# Altium project Bicikli.PrjPcb
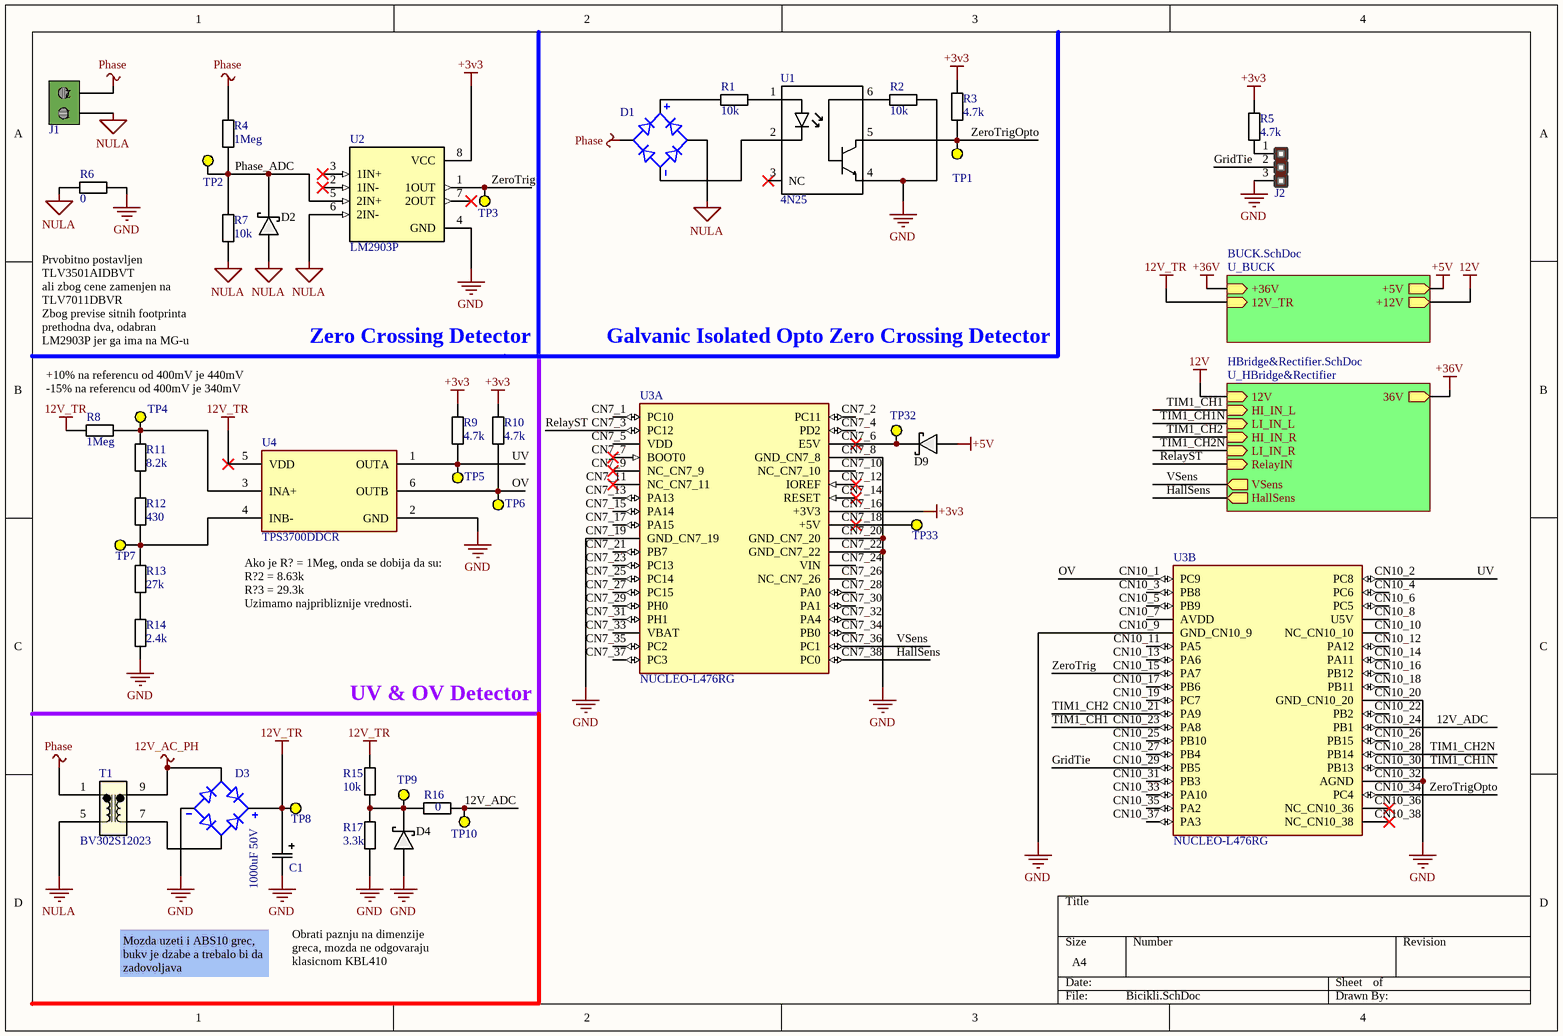
[diagram p0: Bicikli.SchDoc]
3 sheets, 165 parts. Net scope: hierarchical (ports join the sheet entries above them; power ports are global).
Board file: Bicikli_V1.PcbDoc
Sheets:
  Bicikli.SchDoc
    U_HBridge&Rectifier = HBridge&Rectifier.SchDoc
    U_BUCK = BUCK.SchDoc

## Sheet Bicikli.SchDoc
size A4; SheetNumber: 1; SheetTotal: 3

### Parts
C1  1000uF 50V  [CAP_12.5 X 25_NCH]
D1  KBP208G  [SIP350W80P400L1450H1280Q4]  (value not drawn)
D2  SCH_DIODE  [SMA]  (value not drawn)
D3  KBP208G  [SIP350W80P400L1450H1280Q4]  (value not drawn)
D4  SCH_DIODE  [SMA]  (value not drawn)
D9  SCH_DIODE  [SMA]  (value not drawn)
J1  Wire Terminal Block 2 pin 5mm  [WireTerminalPCB5mm2PIN]  (value not drawn)
J2  3Pin  [HEADER3PIN]  (value not drawn)
R1  10k  [RESISTOR_THRUHOLE_1/4W]
R2  10k  [RESISTOR_0805]
R3  4.7k  [RESISTOR_0805]
R4  1Meg  [RESISTOR_THRUHOLE_1/4W]
R5  4.7k  [RESISTOR_0805]
R6  0  [RESISTOR_1206]
R7  10k  [RESISTOR_THRUHOLE_1/4W]
R8  1Meg  [RESISTOR_0805]
R9  4.7k  [RESISTOR_0805]
R10  4.7k  [RESISTOR_0805]
R11  8.2k  [RESISTOR_0805]
R12  430  [RESISTOR_0805]
R13  27k  [RESISTOR_0805]
R14  2.4k  [RESISTOR_0805]
R15  10k  [RESISTOR_0805]
R16  0  [RESISTOR_0805]
R17  3.3k  [RESISTOR_0805]
T1  BV302S12023  [BV302S12023_ZLM]
TP1  TP  [TP]  (value not drawn)
TP2  TP  [TP]  (value not drawn)
TP3  TP  [TP]  (value not drawn)
TP4  TP  [TP]  (value not drawn)
TP5  TP  [TP]  (value not drawn)
TP6  TP  [TP]  (value not drawn)
TP7  TP  [TP]  (value not drawn)
TP8  TP  [TP]  (value not drawn)
TP9  TP  [TP]  (value not drawn)
TP10  TP  [TP]  (value not drawn)
TP32  TP  [TP]  (value not drawn)
TP33  TP  [TP]  (value not drawn)
U1  4N25  [DIP762W50P254L712H400Q6N]
U2  LM2903P  [DIP794W45P254L959H508Q8]
U3  NUCLEO-L476RG  [MODULE_NUCLEO-L476RG]  (parts A,B of 2)
U4  TPS3700DDCR  [FP-DDC0006A-IPC_A]

### Sub-sheets
U_BUCK = BUCK.SchDoc: +5V (out), +36V (in), +12V (out), 12V_TR (in)
U_HBridge&Rectifier = HBridge&Rectifier.SchDoc: HallSens (out), VSens (out), RelayIN (in), HI_IN_L (in), LI_IN_L (in), HI_IN_R (in), LI_IN_R (in), 12V (in), 36V (out)

### Nets
12V: sheet U_HBridge&Rectifier/12V, sheet U_BUCK/+12V
12V_AC_PH: D3.3(AC2) T1.9
12V_TR: C1.1 D3.1(POS) R8.2 R15.2 TP8.1 U4.5(VDD) ; sheet U_BUCK/12V_TR
+3v3: R3.2 R5.2 R9.2 R10.2 U2.8(VCC) U3.CN7_16(+3V3)
+5V: D9.1 ; sheet U_BUCK/+5V
+36V: sheet U_HBridge&Rectifier/36V, sheet U_BUCK/+36V
GND: C1.2 D3.4(NEG) D4.1 J2.3 R2.1 R6.1 R14.1 R17.1 U1.4(E) U2.4(GND) U3.CN7_8(GND_CN7_8) U3.CN7_19(GND_CN7_19) U3.CN7_20(GND_CN7_20) U3.CN7_22(GND_CN7_22) U3.CN10_9(GND_CN10_9) U3.CN10_20(GND_CN10_20) U3.CN10_32(AGND) U4.2(GND)
NULA: D1.2(AC1) D2.1 J1.1 R6.2 R7.1 T1.5 U2.6(2IN-)
Phase: D1.3(AC2) J1.2 R4.2 T1.1
12V_ADC: R16.2 TP10.1 U3.CN10_24(PB1)
GridTie: J2.2 U3.CN10_29(PB5)
HallSens: U3.CN7_38(PC0) ; sheet U_HBridge&Rectifier/HallSens
OV: R10.1 TP6.1 U3.CN10_1(PC9) U4.6(OUTB)
Phase_ADC: D2.2 R4.1 R7.2 TP2.1 U2.5(2IN+)
RelayST: U3.CN7_3(PC12) ; sheet U_HBridge&Rectifier/RelayIN
TIM1_CH1: U3.CN10_23(PA8) ; sheet U_HBridge&Rectifier/HI_IN_L
TIM1_CH1N: U3.CN10_30(PB13) ; sheet U_HBridge&Rectifier/LI_IN_L
TIM1_CH2: U3.CN10_21(PA9) ; sheet U_HBridge&Rectifier/HI_IN_R
TIM1_CH2N: U3.CN10_28(PB14) ; sheet U_HBridge&Rectifier/LI_IN_R
UV: R9.1 TP5.1 U3.CN10_2(PC8) U4.1(OUTA)
VSens: U3.CN7_36(PC1) ; sheet U_HBridge&Rectifier/VSens
ZeroTrig: TP3.1 U2.1(1OUT) U3.CN10_15(PA7)
ZeroTrigOpto: R3.1 TP1.1 U1.5(C) U3.CN10_34(PC4)
NetD1_1: D1.1(POS) R1.2
NetD1_4: D1.4(NEG) U1.2(K)
NetD3_2: D3.2(AC1) T1.7
NetD4_2: D4.2 R15.1 R16.1 R17.2 TP9.1
NetD9_2: D9.2 TP32.1 U3.CN7_6(E5V)
NetJ2_1: J2.1 R5.1
NetR1_1: R1.1 U1.1(A)
NetR2_2: R2.2 U1.6(B)
NetR8_1: R8.1 R11.2 TP4.1 U4.3(INA+)
NetR11_1: R11.1 R12.2
NetR12_1: R12.1 R13.2 TP7.1 U4.4(INB-)
NetR13_1: R13.1 R14.2
NetTP33_1: TP33.1 U3.CN7_18(+5V)

Not connected (* = marked no-connect by the designer): U1 3(NC)*; U2 2(1IN-)* 3(1IN+)* 7(2OUT)*; U3 CN7_1(PC10) CN7_2(PC11) CN7_4(PD2) CN7_5(VDD) CN7_7(BOOT0)* CN7_9(NC_CN7_9)* CN7_10(NC_CN7_10) CN7_11(NC_CN7_11)* CN7_12(IOREF)* CN7_13(PA13) CN7_14(RESET)* CN7_15(PA14) CN7_17(PA15) CN7_21(PB7) CN7_23(PC13) CN7_24(VIN) CN7_25(PC14) CN7_26(NC_CN7_26) CN7_27(PC15) CN7_28(PA0) CN7_29(PH0) CN7_30(PA1) CN7_31(PH1) CN7_32(PA4) CN7_33(VBAT) CN7_34(PB0) CN7_35(PC2) CN7_37(PC3) CN10_3(PB8) CN10_4(PC6) CN10_5(PB9) CN10_6(PC5) CN10_7(AVDD) CN10_8(U5V) CN10_10(NC_CN10_10) CN10_11(PA5) CN10_12(PA12) CN10_13(PA6) CN10_14(PA11) CN10_16(PB12) CN10_17(PB6) CN10_18(PB11) CN10_19(PC7) CN10_22(PB2) CN10_25(PB10) CN10_26(PB15) CN10_27(PB4) CN10_31(PB3) CN10_33(PA10) CN10_35(PA2) CN10_36(NC_CN10_36)* CN10_37(PA3) CN10_38(NC_CN10_38)*

### Notes on the sheet
- (near R7) Prvobitno postavljen TLV3501AIDBVT
  ali zbog cene zamenjen na TLV7011DBVR
  Zbog previse sitnih footprinta prethodna dva, odabran LM2903P jer ga ima na MG-u
- +10% na referencu od 400mV je 440mV
- Zero Crossing Detector
- Galvanic Isolated Opto Zero Crossing Detector
- -15% na referencu od 400mV je 340mV
- (near U4) Ako je R? = 1Meg, onda se dobija da su:
  R?2 = 8.63k
  R?3 = 29.3k
  Uzimamo najpribliznije vrednosti.
- UV & OV Detector
- Mozda uzeti i ABS10 grec, bukv je dzabe a trebalo bi da zadovoljava
- Obrati paznju na dimenzije greca, mozda ne odgovaraju klasicnom KBL410

### Library data of the parts
C1 = UVY1H102MHD: Manufacturer_Name: Nichicon; Copyright: Copyright (C) 2025 Ultra Librarian. All rights reserved.; Manufacturer_Part_Number: UVY1H102MHD
D1 D3 = KBP208G: Bridge Rectifier Single Phase Standard 100 V Through Hole KBP; MF: GeneSiC Semiconductor; MP: KBP202G; SnapEDA_Link: https://www.snapeda.com/parts/KBP202G/GeneSiC+Semiconductor/view-part/?ref=snap; Package: SIP-4 GeneSiC Semiconductor; Value: *; Check_prices: https://www.snapeda.com/parts/KBP202G/GeneSiC+Semiconductor/view-part/?ref=eda
J1 = Wire Terminal Block 2 pin 5mm: Wire Terminal PCB Block 2 pin 5mm
J2 = HEADER3PIN: 3 PIN Male Header 2.54mm pitch
R1 R2 R7 R15 = R000005: RES  10k OHM 1% 1/8W 0805; resistance: 10k
R3 R5 R9 R10 = R000116: RES  4k7 OHM 1% 1/8W 0805; resistance: 4.7k
R4 R8 = R000007: RES  1Meg OHM 1% 1/8W 0805; resistance: 1Meg
R6 R16 = R000000: RES  0 OHM JUMPER 1/8W 0805; resistance: 1; Supplier 1: Mouser; Supplier Part Number 1: 71-CRCW0805-1-E3; Supplier 2: Mouser; Supplier Part Number 2: 667-ERJ-6RQF1R0V; Supplier 3: Mouser; Supplier Part Number 3: 667-ERJ-6BQF1R0V
R11 = R000158: RES  8k2 OHM 1% 1/8W 0805; resistance: 8.2k
R12 = R000108: RES  430 OHM 1% 1/8W 0805; resistance: 430
R13 = R000075: RES  27k OHM 1% 1/8W 0805; resistance: 27k
R14 = R000067: RES  2k4 OHM 1% 1/8W 0805; resistance: 2.4k
R17 = R000088: RES  3k3 OHM 1% 1/8W 0805; resistance: 3.3k
T1 = BV302S12023: No Description Available; Manufacturer_Name: Zettler Magnetics; Type: Power Transformers; Copyright: Copyright (C) 2025 Ultra Librarian. All rights reserved.; Manufacturer_Part_Number: BV302S12023; RefDes: RefDes
TP1-TP10 TP32 TP33 = TP: Test Point 1.5mm radius
U1 = 4N25: Optoisolator, Analog, 6-Pin DIP, Transistor, w/Base Connection | Vishay / Small Signal & Opto Products (SSP) 4N25; MF: Vishay Semiconductor; SnapEDA_Link: https://www.snapeda.com/parts/4N25/Vishay/view-part/?ref=snap; Package: DIP-6 Everlight Electronics CO., LTD; Value: *; MP: 4N25; Check_prices: https://www.snapeda.com/parts/4N25/Vishay/view-part/?ref=eda
U2 = LM2903P: Dual differential comparator; MF: Texas Instruments; SnapEDA_Link: https://www.snapeda.com/parts/LM2903P/Texas+Instruments/view-part/?ref=snap; Package: PDIP-8 Texas; Value: *; MP: LM2903P; Check_prices: https://www.snapeda.com/parts/LM2903P/Texas+Instruments/view-part/?ref=eda
U3 = NUCLEO-L476RG: STM32L476RG, mbed-Enabled Development Nucleo-64 STM32L4 ARMÂ® CortexÂ®-M4 MCU 32-Bit Embedded Evaluation Board; MF: STMicroelectronics; SnapEDA_Link: https://www.snapeda.com/parts/NUCLEO-L476RG/STMicroelectronics/view-part/?ref=snap; Package: None; Value: *; MP: NUCLEO-L476RG; Check_prices: https://www.snapeda.com/parts/NUCLEO-L476RG/STMicroelectronics/view-part/?ref=eda
U4 = CMP-1708-00001-5: IC COMP WINDOW W/REF 6SOT; Operating Supply Current: 5.5uA; Min Supply Voltage: 1.8V; Nominal Supply Current: 7uA; Number of Voltages Monitored: 2; Max Supply Voltage: 18V; Undervoltage Threshold: 1.7V; Quiescent Current: 11uA; Watchdog Timer: No; Number of Channels: 1; Hysteresis: 5.5mV; Propagation Delay: 29us; REACH SVHC: No SVHC; Case/Package: SOT; Number of Pins: 6; Mount: Surface Mount; Radiation Hardening: No; Max Operating Temperature: 125°C; Package Quantity: 3000; Min Operating Temperature: -40°C; Packaging: Tape and Reel; Number of Elements: 2; Lead Free: Lead Free

## Sheet HBridge&Rectifier.SchDoc
size A4; SheetNumber: 3; SheetTotal: 3
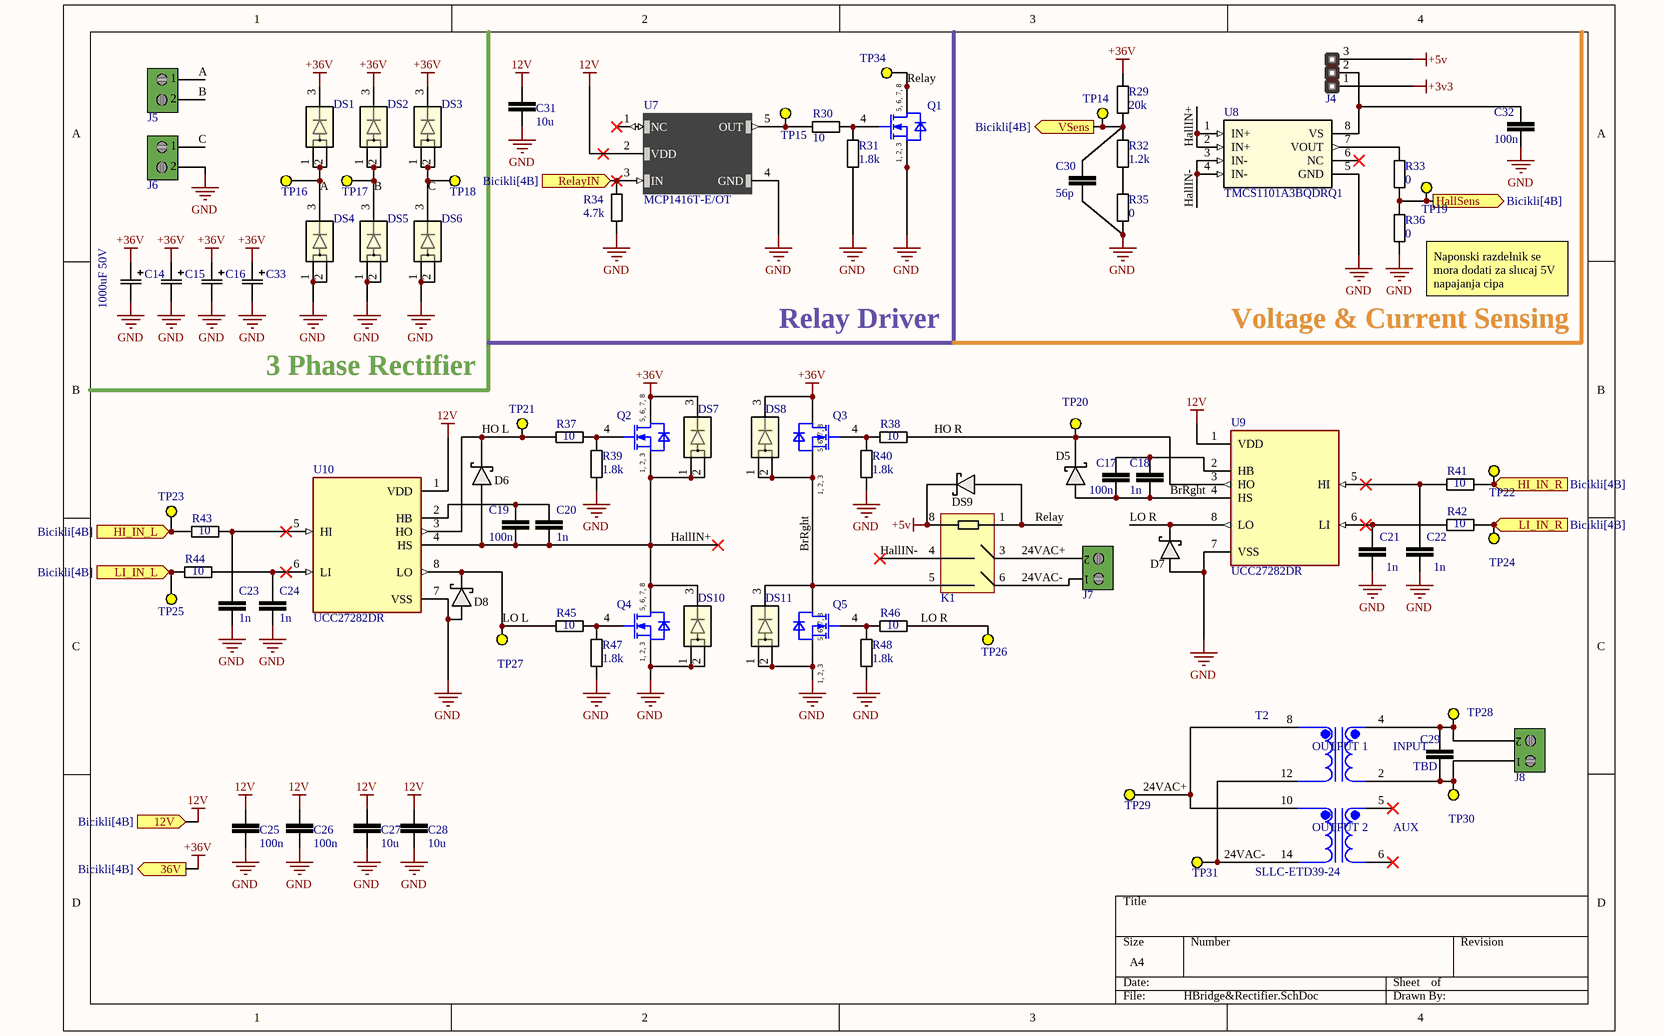
[diagram p1: HBridge&Rectifier.SchDoc]

### Parts
C14  1000uF 50V  [CAP_12.5 X 25_NCH]  (value not drawn)
C15  1000uF 50V  [CAP_12.5 X 25_NCH]  (value not drawn)
C16  1000uF 50V  [CAP_12.5 X 25_NCH]
C17  100n  [CAP_0805]
C18  1n  [CAP_0805]
C19  100n  [CAP_0805]
C20  1n  [CAP_0805]
C21  1n  [CAP_0805]
C22  1n  [CAP_0805]
C23  1n  [CAP_0805]
C24  1n  [CAP_0805]
C25  100n  [CAP_0805]
C26  100n  [CAP_0805]
C27  10u  [CAP_1206]
C28  10u  [CAP_1206]
C29  TBD  [CapacitorBig]
C30  56p  [CAP_0805]
C31  10u  [CAP_1206]
C32  100n  [CAP_0805]
C33  1000uF 50V  [CAP_12.5 X 25_NCH]  (value not drawn)
D5  SCH_DIODE  [SMA]  (value not drawn)
D6  SCH_DIODE  [SMA]  (value not drawn)
D7  SCH_DIODE  [SMA]  (value not drawn)
D8  SCH_DIODE  [SMA]  (value not drawn)
DS1  PMEG45U10EPDZ  [PMEG45U10EPDZ_NEX]  (value not drawn)
DS2  PMEG45U10EPDZ  [PMEG45U10EPDZ_NEX]  (value not drawn)
DS3  PMEG45U10EPDZ  [PMEG45U10EPDZ_NEX]  (value not drawn)
DS4  PMEG45U10EPDZ  [PMEG45U10EPDZ_NEX]  (value not drawn)
DS5  PMEG45U10EPDZ  [PMEG45U10EPDZ_NEX]  (value not drawn)
DS6  PMEG45U10EPDZ  [PMEG45U10EPDZ_NEX]  (value not drawn)
DS7  PMEG45U10EPDZ  [PMEG45U10EPDZ_NEX]  (value not drawn)
DS8  PMEG45U10EPDZ  [PMEG45U10EPDZ_NEX]  (value not drawn)
DS9  SCH_DIODE  [SMA]  (value not drawn)
DS10  PMEG45U10EPDZ  [PMEG45U10EPDZ_NEX]  (value not drawn)
DS11  PMEG45U10EPDZ  [PMEG45U10EPDZ_NEX]  (value not drawn)
J4  3Pin  [HEADER3PIN]  (value not drawn)
J5  Wire Terminal Block 2 pin 5mm  [WireTerminalPCB5mm2PIN]  (value not drawn)
J6  Wire Terminal Block 2 pin 5mm  [WireTerminalPCB5mm2PIN]  (value not drawn)
J7  Wire Terminal Block 2 pin 5mm  [WireTerminalPCB5mm2PIN]  (value not drawn)
J8  Wire Terminal Block 2 pin 5mm  [WireTerminalPCB5mm2PIN]  (value not drawn)
K1  K1  [AZ733-2AE-5DE]  (value not drawn)
Q1  IQE022N06LM5  [IFX-PG-TSON-8-5-V]  (value not drawn)
Q2  IQE022N06LM5  [IFX-PG-TSON-8-5-V]  (value not drawn)
Q3  IQE022N06LM5  [IFX-PG-TSON-8-5-V]  (value not drawn)
Q4  IQE022N06LM5  [IFX-PG-TSON-8-5-V]  (value not drawn)
Q5  IQE022N06LM5  [IFX-PG-TSON-8-5-V]  (value not drawn)
R29  20k  [RESISTOR_0805]
R30  10  [RESISTOR_0805]
R31  1.8k  [RESISTOR_0805]
R32  1.2k  [RESISTOR_0805]
R33  0  [RESISTOR_0805]
R34  4.7k  [RESISTOR_0805]
R35  0  [RESISTOR_0805]
R36  0  [RESISTOR_0805]
R37  10  [RESISTOR_1206]
R38  10  [RESISTOR_1206]
R39  1.8k  [RESISTOR_1206]
R40  1.8k  [RESISTOR_1206]
R41  10  [RESISTOR_1206]
R42  10  [RESISTOR_1206]
R43  10  [RESISTOR_1206]
R44  10  [RESISTOR_1206]
R45  10  [RESISTOR_1206]
R46  10  [RESISTOR_1206]
R47  1.8k  [RESISTOR_1206]
R48  1.8k  [RESISTOR_1206]
T2  SLLC-ETD39-24  [XFMR_SLLC-ETD39-48]
TP14  TP  [TP]  (value not drawn)
TP15  TP  [TP]  (value not drawn)
TP16  TP  [TP]  (value not drawn)
TP17  TP  [TP]  (value not drawn)
TP18  TP  [TP]  (value not drawn)
TP19  TP  [TP]  (value not drawn)
TP20  TP  [TP]  (value not drawn)
TP21  TP  [TP]  (value not drawn)
TP22  TP  [TP]  (value not drawn)
TP23  TP  [TP]  (value not drawn)
TP24  TP  [TP]  (value not drawn)
TP25  TP  [TP]  (value not drawn)
TP26  TP  [TP]  (value not drawn)
TP27  TP  [TP]  (value not drawn)
TP28  TP  [TP]  (value not drawn)
TP29  TP  [TP]  (value not drawn)
TP30  TP  [TP]  (value not drawn)
TP31  TP  [TP]  (value not drawn)
TP34  TP  [TP]  (value not drawn)
U7  MCP1416T-E/OT  [SOT95P270X145-5N]
U8  TMCS1101A3BQDRQ1  [SOIC8_D_TEX]
U9  UCC27282DR  [SOIC127P599X175-8N]
U10  UCC27282DR  [SOIC127P599X175-8N]

### Ports
12V (in, see Bicikli[4B]), 36V (out, see Bicikli[4B]), HallSens (out, see Bicikli[4B]), HI_IN_L (in, see Bicikli[4B]), HI_IN_R (in, see Bicikli[4B]), LI_IN_L (in, see Bicikli[4B]), LI_IN_R (in, see Bicikli[4B]), RelayIN (in, see Bicikli[4B]), VSens (out, see Bicikli[4B])

### Nets
12V: C25.2 C26.2 C27.2 C28.2 C31.2 U7.2(VDD) U9.1(VDD) U10.1(VDD) ; port 12V
+3v3: J4.1
+5V: DS9.2 J4.3 K1.8
+36V: C14.1 C15.1 C16.1 C33.1 DS1.3 DS2.3 DS3.3 DS7.3 DS8.3 Q2.5(DRAIN) Q2.6(DRAIN) Q2.7(DRAIN) Q2.8(DRAIN) Q3.5(DRAIN) Q3.6(DRAIN) Q3.7(DRAIN) Q3.8(DRAIN) R29.2 ; port 36V
GND: C14.2 C15.2 C16.2 C21.1 C22.1 C23.1 C24.1 C25.1 C26.1 C27.1 C28.1 C30.1 C31.1 C32.1 C33.2 D7.1 D8.1 DS4.1 DS4.2 DS5.1 DS5.2 DS6.1 DS6.2 DS10.1 DS10.2 DS11.1 DS11.2 J6.2 Q1.1(SOURCE) Q1.2(SOURCE) Q1.3(SOURCE) Q4.1(SOURCE) Q4.2(SOURCE) Q4.3(SOURCE) Q5.1(SOURCE) Q5.2(SOURCE) Q5.3(SOURCE) R31.1 R34.1 R35.1 R36.1 R39.1 R40.1 R47.1 R48.1 U7.4(GND) U8.5(GND) U9.7(VSS) U10.7(VSS)
24VAC+: J7.2 K1.3 T2.8 T2.10 TP29.1
24VAC-: J7.1 K1.6 T2.12 T2.14 TP31.1
A: DS1.1 DS1.2 DS4.3 J5.1 TP16.1
B: DS2.1 DS2.2 DS5.3 J5.2 TP17.1
BrRght: C17.1 C18.1 D5.1 DS8.1 DS8.2 DS11.3 K1.5 Q3.1(SOURCE) Q3.2(SOURCE) Q3.3(SOURCE) Q5.5(DRAIN) Q5.6(DRAIN) Q5.7(DRAIN) Q5.8(DRAIN) U9.4(HS)
C: DS3.1 DS3.2 DS6.3 J6.1 TP18.1
HallIN+: C19.1 C20.1 D6.1 DS7.1 DS7.2 DS10.3 Q2.1(SOURCE) Q2.2(SOURCE) Q2.3(SOURCE) Q4.5(DRAIN) Q4.6(DRAIN) Q4.7(DRAIN) Q4.8(DRAIN) U8.1(IN+) U8.2(IN+) U10.4(HS)
HallIN-: K1.4 U8.3(IN-) U8.4(IN-)
HallSens: R33.1 R36.2 TP19.1 ; port HallSens
HO L: D6.2 R37.1 TP21.1 U10.3(HO)
HO R: D5.2 R38.2 TP20.1 U9.3(HO)
LO L: D8.2 R45.1 TP27.1 U10.8(LO)
LO R: D7.2 R46.2 TP26.1 U9.8(LO)
Relay: DS9.1 K1.1 Q1.5(DRAIN) Q1.6(DRAIN) Q1.7(DRAIN) Q1.8(DRAIN) TP34.1
RelayST: R34.2 U7.3(IN) ; port RelayIN
TIM1_CH1: R43.1 TP23.1 ; port HI_IN_L
TIM1_CH1N: R44.1 TP25.1 ; port LI_IN_L
TIM1_CH2: R41.2 TP22.1 ; port HI_IN_R
TIM1_CH2N: R42.2 TP24.1 ; port LI_IN_R
VSens: C30.2 R29.1 R32.2 TP14.1 ; port VSens
NetC17_2: C17.2 C18.2 U9.2(HB)
NetC19_2: C19.2 C20.2 U10.2(HB)
NetC21_2: C21.2 R42.1 U9.6(LI)
NetC22_2: C22.2 R41.1 U9.5(HI)
NetC23_2: C23.2 R43.2 U10.5(HI)
NetC24_2: C24.2 R44.2 U10.6(LI)
NetC29_1: C29.1 J8.1 T2.2 TP30.1
NetC29_2: C29.2 J8.2 T2.4 TP28.1
NetC32_2: C32.2 J4.2 U8.8(VS)
NetQ1_4: Q1.4(GATE) R30.2 R31.2
NetQ2_4: Q2.4(GATE) R37.2 R39.2
NetQ3_4: Q3.4(GATE) R38.1 R40.2
NetQ4_4: Q4.4(GATE) R45.2 R47.2
NetQ5_4: Q5.4(GATE) R46.1 R48.2
NetR30_1: R30.1 TP15.1 U7.5(OUT)
NetR32_1: R32.1 R35.2
NetR33_2: R33.2 U8.7(VOUT)

Not connected (* = marked no-connect by the designer): T2 5* 6*; U7 1(NC)*; U8 6(NC)*

### Notes on the sheet
- (near R36) Naponski razdelnik se mora dodati za slucaj 5V napajanja cipa
- 3 Phase Rectifier
- Relay Driver
- Voltage & Current Sensing
- (in symbol IQE022N06LM5) 5, 6, 7, 8; 1, 2, 3
- (in symbol SLLC-ETD39-48) OUTPUT 1; INPUT; OUTPUT 2; AUX

### Library data of the parts
C14-C16 C33 = UVY1H102MHD: Manufacturer_Name: Nichicon; Copyright: Copyright (C) 2025 Ultra Librarian. All rights reserved.; Manufacturer_Part_Number: UVY1H102MHD
C17 C19 C25 C26 C32 = C00079: CAP 100nF ±10% 50V 0805 X7R; capacitance: 100n
C18 C20-C24 = C00059: CAP 1nF ±10% 50V 0805 X7R; capacitance: 1n
C27 C28 C31 = C00085: CAP 10uF ±10% 10V 0805 X5R; capacitance: 10u
C29 = C00059: CAP 1nF ±10% 50V 0805 X7R; capacitance: 1n
C30 = C00039: CAP 56pF ±5% 50V 0805 C0G; capacitance: 56p
DS1-DS8 DS10 DS11 = PMEG45U10EPDZ: No Description Available; Manufacturer_Name: Nexperia; Copyright: Copyright (C) 2025 Ultra Librarian. All rights reserved.; Manufacturer_Part_Number: PMEG45U10EPDZ; RefDes: RefDes; Type: Type
J4 = HEADER3PIN: 3 PIN Male Header 2.54mm pitch
J5-J8 = Wire Terminal Block 2 pin 5mm: Wire Terminal PCB Block 2 pin 5mm
K1 = Relay: AZ733-2AE-5DE Relay
Q1-Q5 = IQE022N06LM5: Insulated-Gate Field-Effect Transistor (IGFET), N-Channel, Enhancement, Body Diode, Pin 1 Source, 2 Source, 3 Source, 4 Gate, 5 Drain, 6 Drain, 7 Drain, 8 Drain, 8 Pins; Manufacturer: Infineon Technologies; PackageReference: PG-TSON-8-5; Manufacturer Order Number: IQE022N06LM5
R29 = R000054: RES  20k OHM 1% 1/8W 0805; resistance: 20k
R30 R37 R38 R41-R46 = R000002: RES  10 OHM 1% 1/8W 0805; resistance: 10
R31 R39 R40 R47 R48 = R000060: RES  1k8 OHM 1% 1/8W 0805; resistance: 2.2k
R32 = R000018: RES  1k2 OHM 1% 1/8W 0805; resistance: 1.2k
R33 R35 R36 = R000000: as R6 on sheet Bicikli; Supplier 1: Mouser; Supplier Part Number 1: 71-CRCW0805-1-E3; Supplier 2: Mouser; Supplier Part Number 2: 667-ERJ-6RQF1R0V; Supplier 3: Mouser; Supplier Part Number 3: 667-ERJ-6BQF1R0V
R34 = R000116: RES  4k7 OHM 1% 1/8W 0805; resistance: 4.7k
T2 = SLLC-ETD39-48: High Frequency Resonant Transformers; MF: Signal Transformer; SnapEDA_Link: https://www.snapeda.com/parts/SLLC-ETD39-48/Signal+Transformer/view-part/?ref=snap; Package: None; Value: *; MP: SLLC-ETD39-48; Check_prices: https://www.snapeda.com/parts/SLLC-ETD39-48/Signal+Transformer/view-part/?ref=eda
TP14-TP31 TP34 = TP: Test Point 1.5mm radius
U7 = MCP1416T-E/OT: Low-Side Gate Driver IC Non-Inverting SOT-23-5; MF: Microchip; Price: None; Availability: Good; SnapEDA_Link: https://www.snapeda.com/parts/MCP1416T-E/OT/Microchip/view-part/287469/?ref=snap; Package: SOT-23-5 Microchip; MP: MCP1416T-E/OT; Value: *; Purchase-URL: https://pricing.snapeda.com/search/part/MCP1416T-E/OT/?ref=eda; Check_prices: https://www.snapeda.com/parts/MCP1416T-E/OT/Microchip/view-part/287469/?ref=eda
U8 = TMCS1101A3BQDRQ1: AEC-Q100, Â±600-V,Â precision, isolated current sensor with internal reference 8-SOIC -40 to 125; Manufacturer_Name: Texas Instruments; Copyright: Copyright (C) 2025 Ultra Librarian. All rights reserved.; Manufacturer_Part_Number: TMCS1101A3BQDRQ1; Datasheet: https://www.ti.com/lit/gpn/tmcs1101-q1; RefDes: RefDes; Type: Type
U9 U10 = UCC27282DR: 3-A, 120-V half-bridge gate driver with 5-V UVLO, interlock and enable; MF: Texas Instruments; SnapEDA_Link: https://www.snapeda.com/parts/UCC27282DR/Texas+Instruments/view-part/?ref=snap; Package: None; Value: *; MP: UCC27282DR; Check_prices: https://www.snapeda.com/parts/UCC27282DR/Texas+Instruments/view-part/?ref=eda

## Sheet BUCK.SchDoc
size A4; SheetNumber: 2; SheetTotal: 3
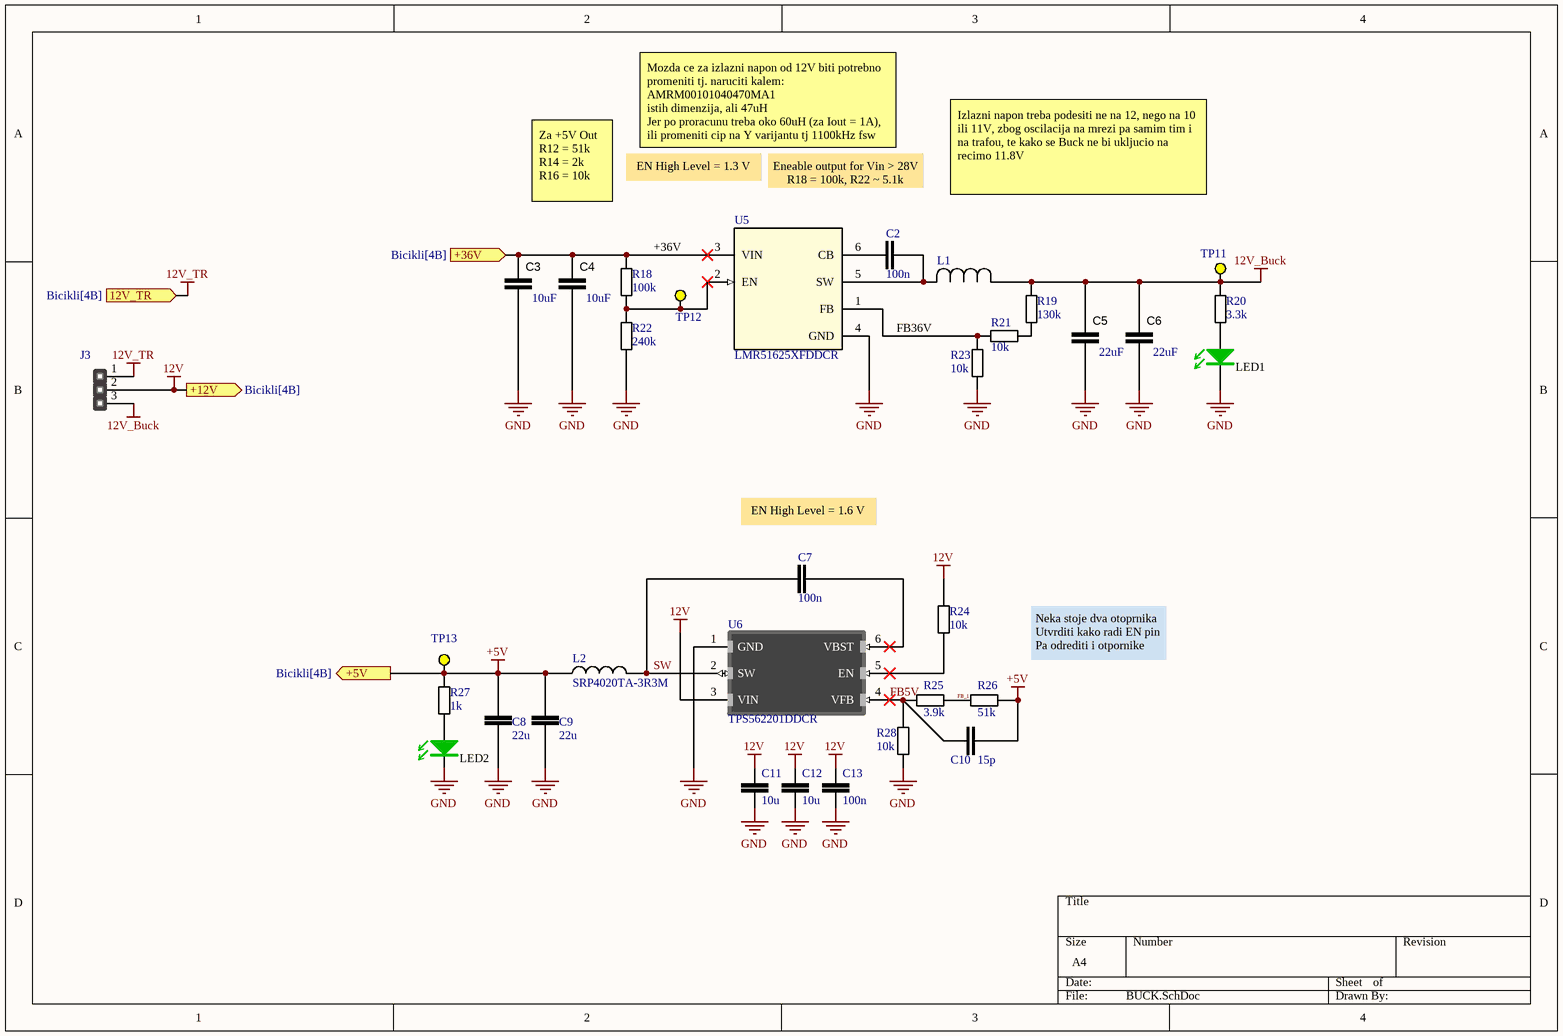
[diagram p2: BUCK.SchDoc]

### Parts
C2  100n  [CAP_0805]
C3  10uF  [CAP_1206]
C4  10uF  [CAP_1206]
C5  22uF  [CAP_1206]
C6  22uF  [CAP_1206]
C7  100n  [CAP_0805]
C8  22u  [CAP_0805]
C9  22u  [CAP_0805]
C10  15p  [CAP_0805]
C11  10u  [CAP_1206]
C12  10u  [CAP_1206]
C13  100n  [CAP_0805]
J3  3Pin  [HEADER3PIN]  (value not drawn)
L1  AMRM00101040100MA1  [IND_AMRM00101040_PUL]  (value not drawn)
L2  SRP4020TA-3R3M  [IND_SRP4020TA-3R3M]
LED1  LED GREEN  [LED_GREEN_0805]  (value not drawn)
LED2  LED GREEN  [LED_GREEN_0805]  (value not drawn)
R18  100k  [RESISTOR_0805_SMALLSILK]
R19  130k  [RESISTOR_0805_SMALLSILK]
R20  3.3k  [RESISTOR_0805_SMALLSILK]
R21  10k  [RESISTOR_0805_SMALLSILK]
R22  240k  [RESISTOR_0805_SMALLSILK]
R23  10k  [RESISTOR_0805_SMALLSILK]
R24  10k  [RESISTOR_0805_SMALLSILK]
R25  3.9k  [RESISTOR_0805_SMALLSILK]
R26  51k  [RESISTOR_0805_SMALLSILK]
R27  1k  [RESISTOR_0805_SMALLSILK]
R28  10k  [RESISTOR_0805_SMALLSILK]
TP11  TP  [TP]  (value not drawn)
TP12  TP  [TP]  (value not drawn)
TP13  TP  [TP]  (value not drawn)
U5  LMR51625XFDDCR  [DDC0006A-MFG]
U6  TPS562201DDCR  [SOT95P280X110-6N]

### Ports
12V_TR (in, see Bicikli[4B]), +5V (out, see Bicikli[4B]), +12V (out, see Bicikli[4B]), +36V (in, see Bicikli[4B])

### Nets
12V: C11.2 C12.2 C13.2 J3.2 R24.2 U6.3(VIN) ; port +12V
12V_Buck: C5.2 C6.2 J3.3 L1.1 R19.2 R20.2 TP11.1
12V_TR: J3.1 ; port 12V_TR
+5V: C8.2 C9.2 C10.2 L2.1 R26.2 R27.2 TP13.1 ; port +5V
+36V: C3.2 C4.2 R18.2 U5.3(VIN) ; port +36V
GND: C3.1 C4.1 C5.1 C6.1 C8.1 C9.1 C11.1 C12.1 C13.1 LED1.1(C) LED2.1(C) R22.1 R23.1 R28.1 U5.4(GND) U6.1(GND)
FB5V: C10.1 R25.1 R28.2 U6.4(VFB)
FB36V: R21.2 R23.2 U5.1(FB)
FB_1: R25.2 R26.1
SW: C7.1 L2.2 U6.2(SW)
NetC2_1: C2.1 U5.6(CB)
NetC2_2: C2.2 L1.2 U5.5(SW)
NetC7_2: C7.2 U6.6(VBST)
NetLED1_2: LED1.2(A) R20.1
NetLED2_2: LED2.2(A) R27.1
NetR18_1: R18.1 R22.2 TP12.1 U5.2(EN)
NetR19_1: R19.1 R21.1
NetR24_1: R24.1 U6.5(EN)

### Notes on the sheet
- EN High Level = 1.3 V
- Mozda ce za izlazni napon od 12V biti potrebno promeniti tj. naruciti kalem:
  AMRM00101040470MA1
  istih dimenzija, ali 47uH
  Jer po proracunu treba oko 60uH (za Iout = 1A), ili promeniti cip na Y varijantu tj 1100kHz fsw
- Za +5V Out
  R12 = 51k
  R14 = 2k
  R16 = 10k
- Eneable output for Vin > 28V
  R18 = 100k, R22 ~ 5.1k
- Izlazni napon treba podesiti ne na 12, nego na 10 ili 11V, zbog oscilacija na mrezi pa samim tim i na trafou, te kako se Buck ne bi ukljucio na recimo 11.8V
- EN High Level = 1.6 V
- (near R26) Neka stoje dva otoprnika
  Utvrditi kako radi EN pin
  Pa odrediti i otpornike

### Library data of the parts
C2 C7 C13 = C00079: CAP 100nF ±10% 50V 0805 X7R; capacitance: 100n
C3 C4 = C000020: 10 µF ±10% 50V Ceramic Capacitor X7R 1206 (3216 Metric); capacitance: 22uF; ComponentLink1Description: DigiKey; ComponentLink1URL: https://www.digikey.com/en/products/detail/samsung-electro-mechanics/CL31A226KAHNNNE/3888705; DigiKey Part Number: 1276-3047-1-ND
C5 C6 = C000020: 22 µF ±10% 25V Ceramic Capacitor X5R 1206 (3216 Metric); capacitance: 22uF; ComponentLink1Description: DigiKey; ComponentLink1URL: https://www.digikey.com/en/products/detail/samsung-electro-mechanics/CL31A226KAHNNNE/3888705; DigiKey Part Number: 1276-3047-1-ND
C8 C9 = C00086: CAP 22uF ±20% 10V 0805 X5R; capacitance: 22u
C10 = C00026: CAP 15pF ±5% 50V 0805 C0G; capacitance: 15p
C11 C12 = C00084: CAP 10uF ±10% 25V 0805 X5R; capacitance: 4.7u
J3 = HEADER3PIN: 3 PIN Male Header 2.54mm pitch
L1 = AMRM00101040100MA1: No Description Available; Manufacturer_Name: Pulse Electronics Corporation; Type: Fixed Inductors; Copyright: Copyright (C) 2025 Ultra Librarian. All rights reserved.; Manufacturer_Part_Number: AMRM00101040100MA1
L2 = SRP4020TA-3R3M: Surface Mount Power Inductor, AEC-Q200 SRP4020TA Series, 15 H, 20%, Shielded, 0.374 ohm, 1.5 A; MF: {'manufacturer': u'Bourns'}; Package: None; Price: None; Value: *; MP: SRP4020TA-3R3M; Availability: Unavailable
LED1 LED2 = LED_GREEN 0805: LED GREEN CLEAR 0805 SMD; Manufacturer: Kingbright; Manufacturer Part Number: APT2012SGC; Barcode: 2911010024338; id: 28; Voltage Forward: 2.2V; Wavelength: 568nm; Lens Color: Colorless; item_id: 3342; Recommended Rating: Platinum; Category: Optoelectronics; Assembly: SMD; Datasheet URL: http://www.kingbrightusa.com/images/catalog/SPEC/APT2012SGC.pdf; Package Case: 0805 (2012 Metric); Color: Green; Family: LED; Lens Transparency: Clear; Part Type: Optoelectronics
R18 = R000006: RES  100k OHM 1% 1/8W 0805; resistance: 100k
R19 = R000027: RES  130k OHM 1% 1/8W 0805; resistance: 130k
R20 = R000088: RES  3k3 OHM 1% 1/8W 0805; resistance: 3.3k
R21 R23 R24 R28 = R000005: RES  10k OHM 1% 1/8W 0805; resistance: 10k
R22 = R000069: RES  240k OHM 1% 1/8W 0805; resistance: 240k
R25 = R000102: RES  3k9 OHM 1% 1/8W 0805; resistance: 3.9k
R26 = R000124: RES  51k OHM 1% 1/8W 0805; resistance: 51k
R27 = R000004: RES  1k OHM 1% 1/8W 0805; resistance: 1k
TP11-TP13 = TP: Test Point 1.5mm radius
U5 = LMR51625XFDDCR: SIMPLE SWITCHERÂ® synchronous buck converter with 4.3V-to-60V, 2.5A and low quiescent current 6-SOT-23-THIN -40 to 150; Manufacturer_Name: Texas Instruments; TYPE: TYPE; RefDes: RefDes; Copyright: Copyright (C) 2025 Ultra Librarian. All rights reserved.; Manufacturer_Part_Number: LMR51625XFDDCR; Datasheet: https://www.ti.com/lit/gpn/lmr51625
U6 = TPS562201DDCR: 4.5 V to 17 V input, 2 A output, synchronous step-down converter in Eco-mode 6-SOT-23-THIN -40 to 125; MF: {'manufacturer': u'Texas Instruments'}; Package: None; Price: None; Value: *; MP: TPS562201DDCR; Availability: Unavailable

## Nets that join several sheets
12V: HBridge&Rectifier (8 pins), BUCK (6 pins)
12V_TR: Bicikli (6 pins), BUCK (J3.1)
+3v3: Bicikli (6 pins), HBridge&Rectifier (J4.1)
+5V: Bicikli (D9.1), HBridge&Rectifier (DS9.2 J4.3 K1.8), BUCK (7 pins)
+36V: HBridge&Rectifier (18 pins), BUCK (C3.2 C4.2 R18.2 U5.3)
GND: Bicikli (18 pins), HBridge&Rectifier (49 pins), BUCK (16 pins)
HallSens: Bicikli (U3.CN7_38), HBridge&Rectifier (R33.1 R36.2 TP19.1)
RelayST: Bicikli (U3.CN7_3), HBridge&Rectifier (R34.2 U7.3)
TIM1_CH1: Bicikli (U3.CN10_23), HBridge&Rectifier (R43.1 TP23.1)
TIM1_CH1N: Bicikli (U3.CN10_30), HBridge&Rectifier (R44.1 TP25.1)
TIM1_CH2: Bicikli (U3.CN10_21), HBridge&Rectifier (R41.2 TP22.1)
TIM1_CH2N: Bicikli (U3.CN10_28), HBridge&Rectifier (R42.2 TP24.1)
VSens: Bicikli (U3.CN7_36), HBridge&Rectifier (C30.2 R29.1 R32.2 TP14.1)